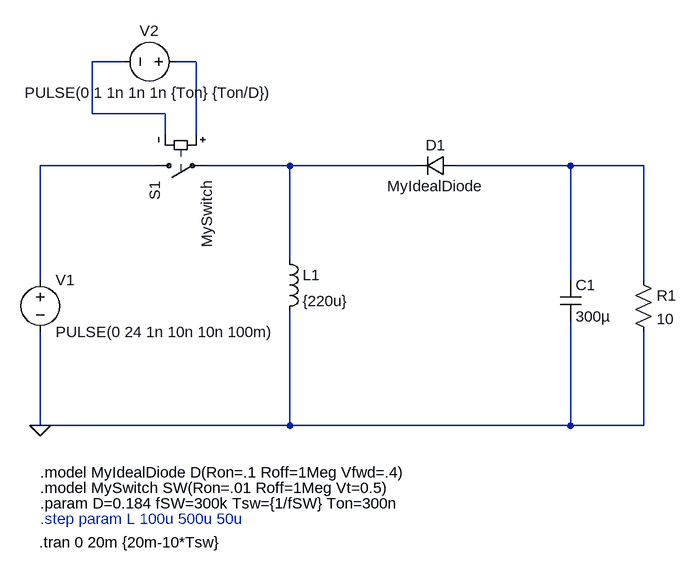
[diagram p0: schematic Buck_Boost_Constant_on_Time.asc]
Buck_Boost_Constant_on_Time.asc, the LTspice schematic file:
Version 4
SHEET 1 968 680
WIRE 112 -224 64 -224
WIRE 224 -224 192 -224
WIRE 64 -144 64 -224
WIRE 176 -144 64 -144
WIRE 176 -112 176 -144
WIRE 224 -112 224 -224
WIRE 160 -64 -16 -64
WIRE 368 -64 240 -64
WIRE 560 -64 368 -64
WIRE 800 -64 624 -64
WIRE 912 -64 800 -64
WIRE 368 80 368 -64
WIRE -16 112 -16 -64
WIRE 800 112 800 -64
WIRE 912 112 912 -64
WIRE -16 336 -16 192
WIRE 368 336 368 160
WIRE 368 336 -16 336
WIRE 800 336 800 176
WIRE 800 336 368 336
WIRE 912 336 912 192
WIRE 912 336 800 336
FLAG -16 336 0
SYMBOL voltage -16 96 R0
WINDOW 123 0 0 Left 0
WINDOW 39 0 0 Left 0
SYMATTR InstName V1
SYMATTR Value PULSE(0 24 1n 10n 10n 100m)
SYMBOL voltage 208 -224 R90
WINDOW 0 -32 56 VBottom 2
WINDOW 3 32 56 VTop 2
WINDOW 123 0 0 Left 0
WINDOW 39 0 0 Left 0
SYMATTR InstName V2
SYMATTR Value PULSE(0 1 1n 1n 1n {Ton} {Ton/D})
SYMBOL ind 352 64 R0
SYMATTR InstName L1
SYMATTR Value {220u}
SYMBOL sw 144 -64 M90
SYMATTR InstName S1
SYMATTR Value MySwitch
SYMBOL cap 784 112 R0
SYMATTR InstName C1
SYMATTR Value 300µ
SYMBOL res 896 96 R0
SYMATTR InstName R1
SYMATTR Value 10
SYMBOL diode 624 -80 R90
WINDOW 0 0 32 VBottom 2
WINDOW 3 32 32 VTop 2
SYMATTR InstName D1
SYMATTR Value MyIdealDiode
TEXT -16 432 Left 2 !.model MySwitch SW(Ron=.01 Roff=1Meg Vt=0.5)
TEXT -16 456 Left 2 !.param D=0.184 fSW=300k Tsw={1/fSW} Ton=300n
TEXT -18 516 Left 2 !.tran 0 20m {20m-10*Tsw}
TEXT -16 408 Left 2 !.model MyIdealDiode D(Ron=.1 Roff=1Meg Vfwd=.4)
TEXT -16 480 Left 2 ;.step param L 100u 500u 50u

The netlist it stands for:
* Buck_Boost_Constant_on_Time.asc
V1 N003 0 PULSE(0 24 1n 10n 10n 100m)
V2 N002 N001 PULSE(0 1 1n 1n 1n {Ton} {Ton/D})
L1 N004 0 {220u}
S1 N003 N004 N002 N001 MySwitch
C1 N005 0 300µ
R1 N005 0 10
D1 N005 N004 MyIdealDiode
.model D D
.lib standard.dio
.model MySwitch SW(Ron=.01 Roff=1Meg Vt=0.5)
.param D=0.184 fSW=300k Tsw={1/fSW} Ton=300n
.tran 0 20m {20m-10*Tsw}
.model MyIdealDiode D(Ron=.1 Roff=1Meg Vfwd=.4)
* .step param L 100u 500u 50u
.backanno
.end